# Altium project SideLine.PrjPcb
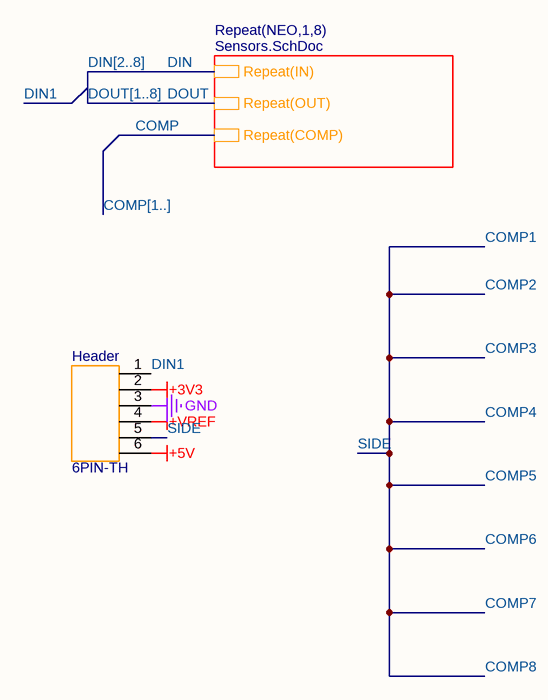
[diagram p0: Connexions.SchDoc]
2 sheets, 57 parts. Net scope: hierarchical (ports join the sheet entries above them; power ports are global).
Board file: SideLine.PcbDoc
Sheets:
  Connexions.SchDoc
    NEO1 = Sensors.SchDoc
    NEO2 = Sensors.SchDoc
    NEO3 = Sensors.SchDoc
    NEO4 = Sensors.SchDoc
    NEO5 = Sensors.SchDoc
    NEO6 = Sensors.SchDoc
    NEO7 = Sensors.SchDoc
    NEO8 = Sensors.SchDoc

## Sheet Connexions.SchDoc
size A; SheetNumber: 1; SheetTotal: 2

### Parts
Header  6PIN-TH  [6PIN-TH]

### Sub-sheets
Repeat(NEO,1,8) = Sensors.SchDoc: Repeat(IN), Repeat(OUT), Repeat(COMP)

### Nets
+3V3: Header.2
+5V: Header.6
+VREF: Header.4
GND: Header.3
COMP: sheet Repeat(NEO,1,8)/Repeat(COMP)
COMP1: Header.5  [also labelled COMP2, COMP3, COMP4, COMP5, COMP6, COMP7, COMP8, SIDE]
DIN: sheet Repeat(NEO,1,8)/Repeat(IN)
DIN1: Header.1
DOUT: sheet Repeat(NEO,1,8)/Repeat(OUT)

### Buses and harness runs
bus COMP[1..]
bus DIN[2..8] = DOUT[1..8]

## Sheet Sensors.SchDoc
size A; SheetNumber: 2; SheetTotal: 2
Used 8 times, as channels NEO1, NEO2, NEO3, NEO4, NEO5, NEO6, NEO7, NEO8. Parts and nets are listed once, with the designators drawn on the sheet.
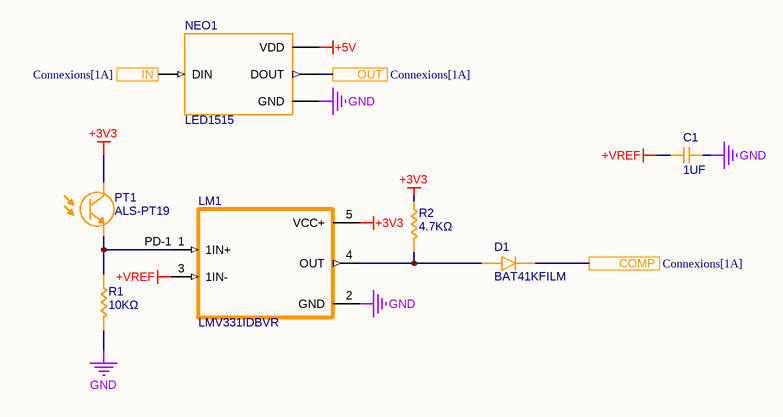
[diagram p1: Sensors.SchDoc]

### Parts
C1  1UF  [CAP_0603]
D1  BAT41KFILM  [BAT41KFILM]
LM1  LMV331IDBVR  [LMV331IDBVR]
NEO1  LED1515  [LED1515]
PT1  ALS-PT19  [ALS-PT19]
R1  10KΩ  [RES_0603]
R2  4.7KΩ  [RES_0603]

### Ports
COMP (see Connexions[1A]), IN (see Connexions[1A]), OUT (see Connexions[1A])

### Nets
+3V3: LM1.5(VCC+) PT1.C R2.2
+5V: NEO1.VDD
+VREF: C1.2 LM1.3(1IN-)
GND: C1.1 LM1.2(GND) NEO1.GND R1.1
COMP: D1.C(K) ; port COMP
IN: NEO1.DIN ; port IN
OUT: NEO1.DOUT ; port OUT
PD-1: LM1.1(1IN+) PT1.E R1.2
NetD1_A: D1.A LM1.4(OUT) R2.1

### Channels
NEO1: designators end in _NEO1; ports COMP=COMP1 IN=DIN1 OUT=DIN2
NEO2: designators end in _NEO2; ports COMP=COMP1 IN=DIN2 OUT=DIN3
NEO3: designators end in _NEO3; ports COMP=COMP1 IN=DIN3 OUT=DIN4
NEO4: designators end in _NEO4; ports COMP=COMP1 IN=DIN4 OUT=DIN5
NEO5: designators end in _NEO5; ports COMP=COMP1 IN=DIN5 OUT=DIN6
NEO6: designators end in _NEO6; ports COMP=COMP1 IN=DIN6 OUT=DIN7
NEO7: designators end in _NEO7; ports COMP=COMP1 IN=DIN7 OUT=DIN8
NEO8: designators end in _NEO8; ports COMP=COMP1 IN=DIN8 OUT=DOUT8

### Library data of the parts
C1 = CAP_0603: Capacitor SMD 0603 generic
R1 R2 = RES_0603: Resistor SMD 0603 generic

## Nets that join several sheets
+3V3: Connexions (Header.2), NEO1 (LM1_NEO1.5 PT1_NEO1.C R2_NEO1.2), NEO2 (LM1_NEO2.5 PT1_NEO2.C R2_NEO2.2), NEO3 (LM1_NEO3.5 PT1_NEO3.C R2_NEO3.2), NEO4 (LM1_NEO4.5 PT1_NEO4.C R2_NEO4.2), NEO5 (LM1_NEO5.5 PT1_NEO5.C R2_NEO5.2), NEO6 (LM1_NEO6.5 PT1_NEO6.C R2_NEO6.2), NEO7 (LM1_NEO7.5 PT1_NEO7.C R2_NEO7.2), NEO8 (LM1_NEO8.5 PT1_NEO8.C R2_NEO8.2)
+5V: Connexions (Header.6), NEO1 (NEO1_NEO1.VDD), NEO2 (NEO1_NEO2.VDD), NEO3 (NEO1_NEO3.VDD), NEO4 (NEO1_NEO4.VDD), NEO5 (NEO1_NEO5.VDD), NEO6 (NEO1_NEO6.VDD), NEO7 (NEO1_NEO7.VDD), NEO8 (NEO1_NEO8.VDD)
+VREF: Connexions (Header.4), NEO1 (C1_NEO1.2 LM1_NEO1.3), NEO2 (C1_NEO2.2 LM1_NEO2.3), NEO3 (C1_NEO3.2 LM1_NEO3.3), NEO4 (C1_NEO4.2 LM1_NEO4.3), NEO5 (C1_NEO5.2 LM1_NEO5.3), NEO6 (C1_NEO6.2 LM1_NEO6.3), NEO7 (C1_NEO7.2 LM1_NEO7.3), NEO8 (C1_NEO8.2 LM1_NEO8.3)
GND: Connexions (Header.3), NEO1 (C1_NEO1.1 LM1_NEO1.2 NEO1_NEO1.GND R1_NEO1.1), NEO2 (C1_NEO2.1 LM1_NEO2.2 NEO1_NEO2.GND R1_NEO2.1), NEO3 (C1_NEO3.1 LM1_NEO3.2 NEO1_NEO3.GND R1_NEO3.1), NEO4 (C1_NEO4.1 LM1_NEO4.2 NEO1_NEO4.GND R1_NEO4.1), NEO5 (C1_NEO5.1 LM1_NEO5.2 NEO1_NEO5.GND R1_NEO5.1), NEO6 (C1_NEO6.1 LM1_NEO6.2 NEO1_NEO6.GND R1_NEO6.1), NEO7 (C1_NEO7.1 LM1_NEO7.2 NEO1_NEO7.GND R1_NEO7.1), NEO8 (C1_NEO8.1 LM1_NEO8.2 NEO1_NEO8.GND R1_NEO8.1)
COMP1: Connexions (Header.5), NEO1 (D1_NEO1.C), NEO2 (D1_NEO2.C), NEO3 (D1_NEO3.C), NEO4 (D1_NEO4.C), NEO5 (D1_NEO5.C), NEO6 (D1_NEO6.C), NEO7 (D1_NEO7.C), NEO8 (D1_NEO8.C)
DIN1: Connexions (Header.1), NEO1 (NEO1_NEO1.DIN)
DIN2: NEO1 (NEO1_NEO1.DOUT), NEO2 (NEO1_NEO2.DIN)
DIN3: NEO2 (NEO1_NEO2.DOUT), NEO3 (NEO1_NEO3.DIN)
DIN4: NEO3 (NEO1_NEO3.DOUT), NEO4 (NEO1_NEO4.DIN)
DIN5: NEO4 (NEO1_NEO4.DOUT), NEO5 (NEO1_NEO5.DIN)
DIN6: NEO5 (NEO1_NEO5.DOUT), NEO6 (NEO1_NEO6.DIN)
DIN7: NEO6 (NEO1_NEO6.DOUT), NEO7 (NEO1_NEO7.DIN)
DIN8: NEO7 (NEO1_NEO7.DOUT), NEO8 (NEO1_NEO8.DIN)